# EAGLE schematic projekt (EAGLE 7.7.0)
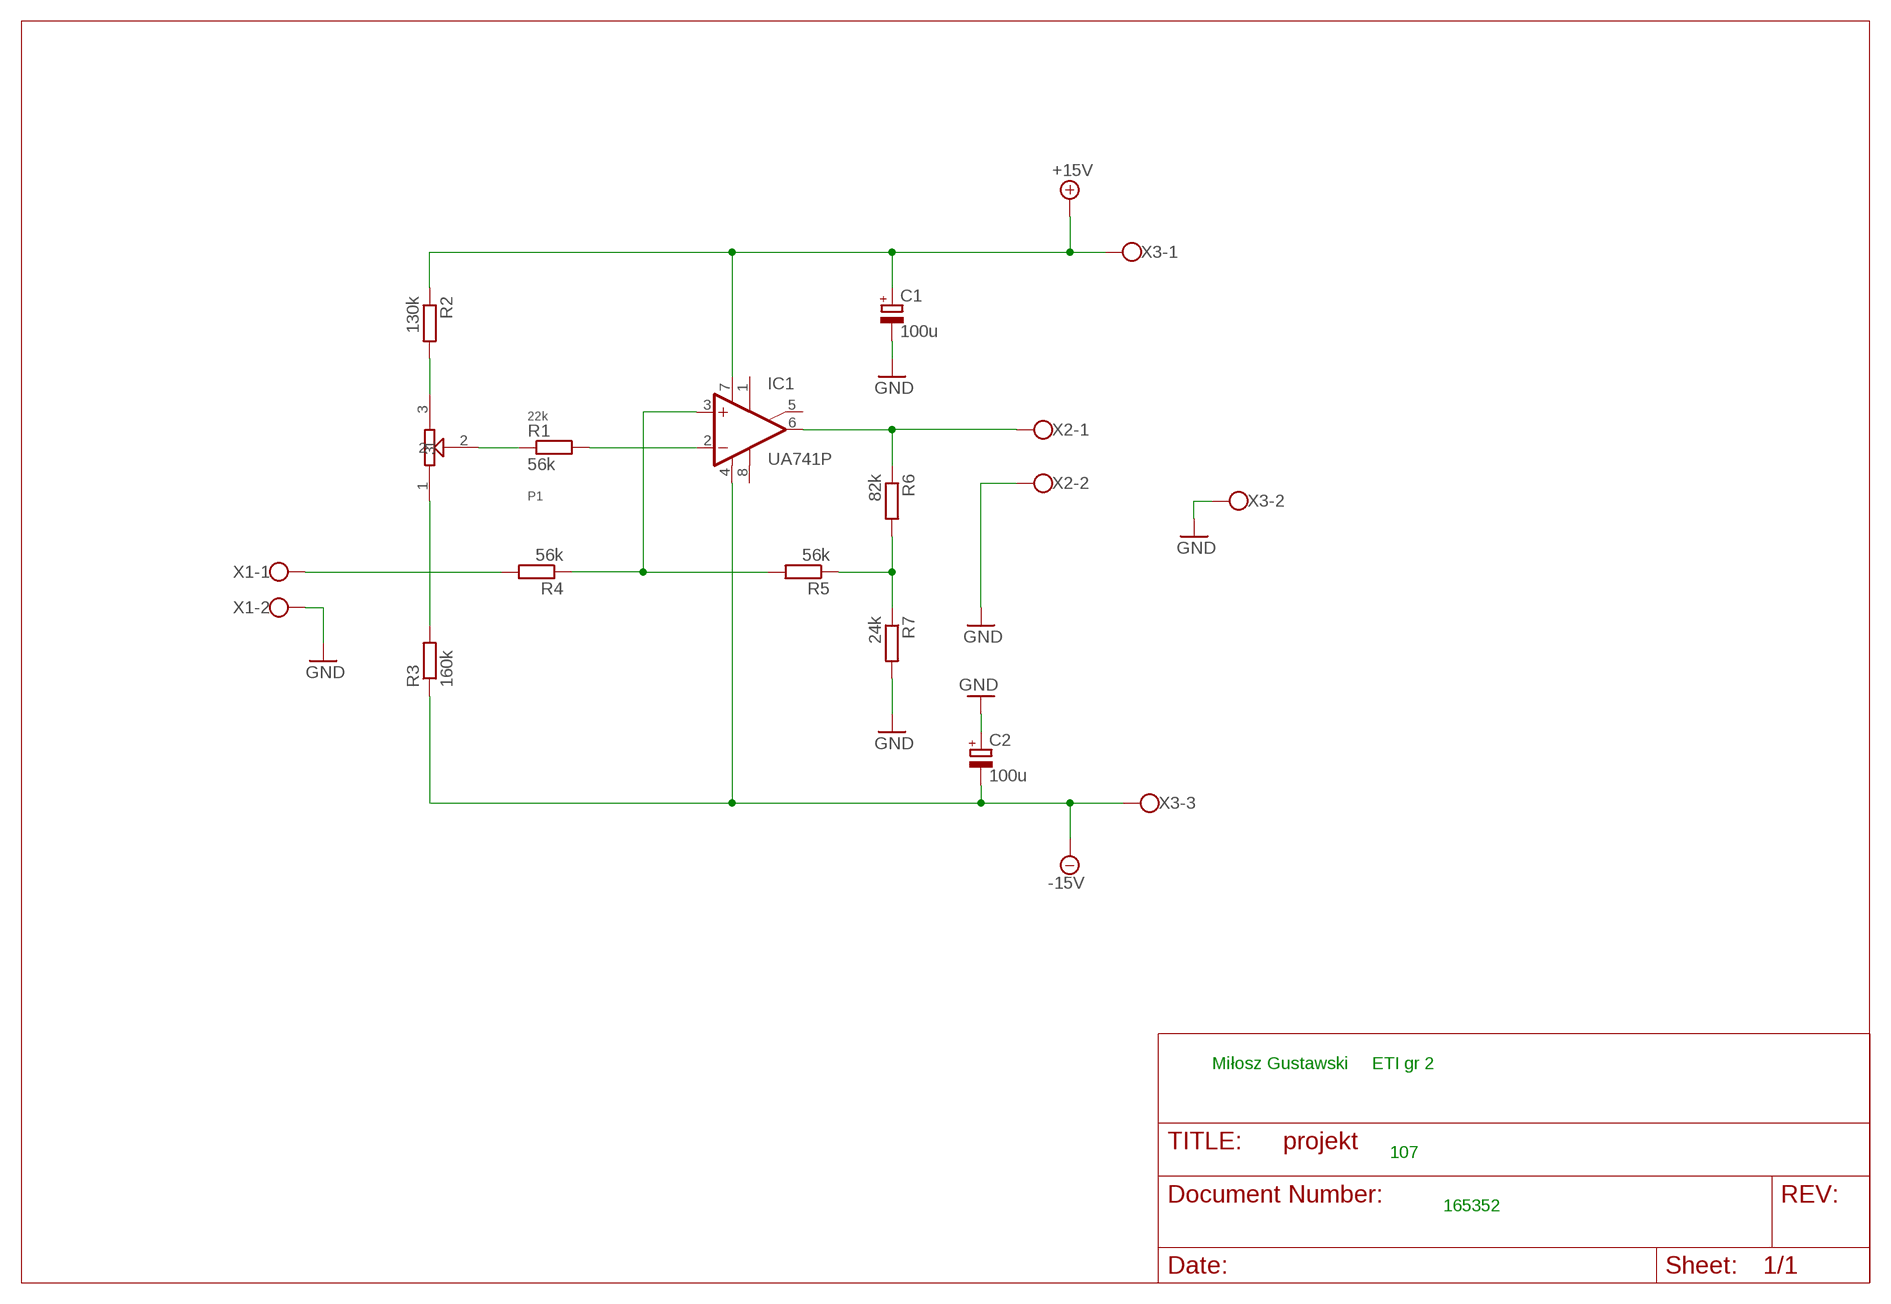
[diagram p0: schematic, sheet 1]

## Parts
C1  100u  CPOL-EU140CLH-1014  [140CLH-1014]
C2  100u  CPOL-EU140CLH-1014  [140CLH-1014]
IC1  UA741P  [DIL08]
P1  22k  POTENCJOMETR  [CN15.2]
R1  56k  R-EU_0207/10  [0207/10]
R2  130k  R-EU_0207/10  [0207/10]
R3  160k  R-EU_0207/10  [0207/10]
R4  56k  R-EU_0207/10  [0207/10]
R5  56k  R-EU_0207/10  [0207/10]
R6  82k  R-EU_0207/10  [0207/10]
R7  24k  R-EU_0207/10  [0207/10]
X1  W237-102  [W237-102]
X2  W237-102  [W237-102]
X3  W237-103  [W237-103]

## Nets
+15V: C1.+ IC1.7(V+) R2.1 X3.1
-15V: C2.- IC1.4(V-) R3.1 X3.3
GND: C1.- C2.+ R7.2 X1.2 X2.2 X3.2
N$1: R4.2 X1.1
N$2: IC1.2(-IN) R1.2
N$3: P1.3 R2.2
N$4: P1.1 R3.2
N$5: P1.2 R1.1
N$6: IC1.3(+IN) R4.1 R5.2
N$7: R5.1 R6.2 R7.1
N$8: IC1.6(OUT) R6.1 X2.1
Unconnected: IC1.1(ON1) IC1.5(ON2) IC1.8(OPT)

## Notes on the sheet
- Miłosz Gustawski | ETI gr 2
- 107
- 165352

## Library data of the parts
C1 C2 = rcl:CPOL-EU: POLARIZED CAPACITOR, European symbol
IC1 = linear:*741: OP AMP
P1 = gustawski:POTENCJOMETR
R1-R7 = rcl:R-EU_: RESISTOR, European symbol
X1 X2 = con-wago-500:W237-102: WAGO SCREW CLAMP; MPN: 237-102; OC_FARNELL: unknown; OC_NEWARK: 70K9898
X3 = con-wago-500:W237-103: WAGO SCREW CLAMP; MPN: 237-103; OC_FARNELL: unknown; OC_NEWARK: 18M7116